# EAGLE design controller (EAGLE 6.6.0)
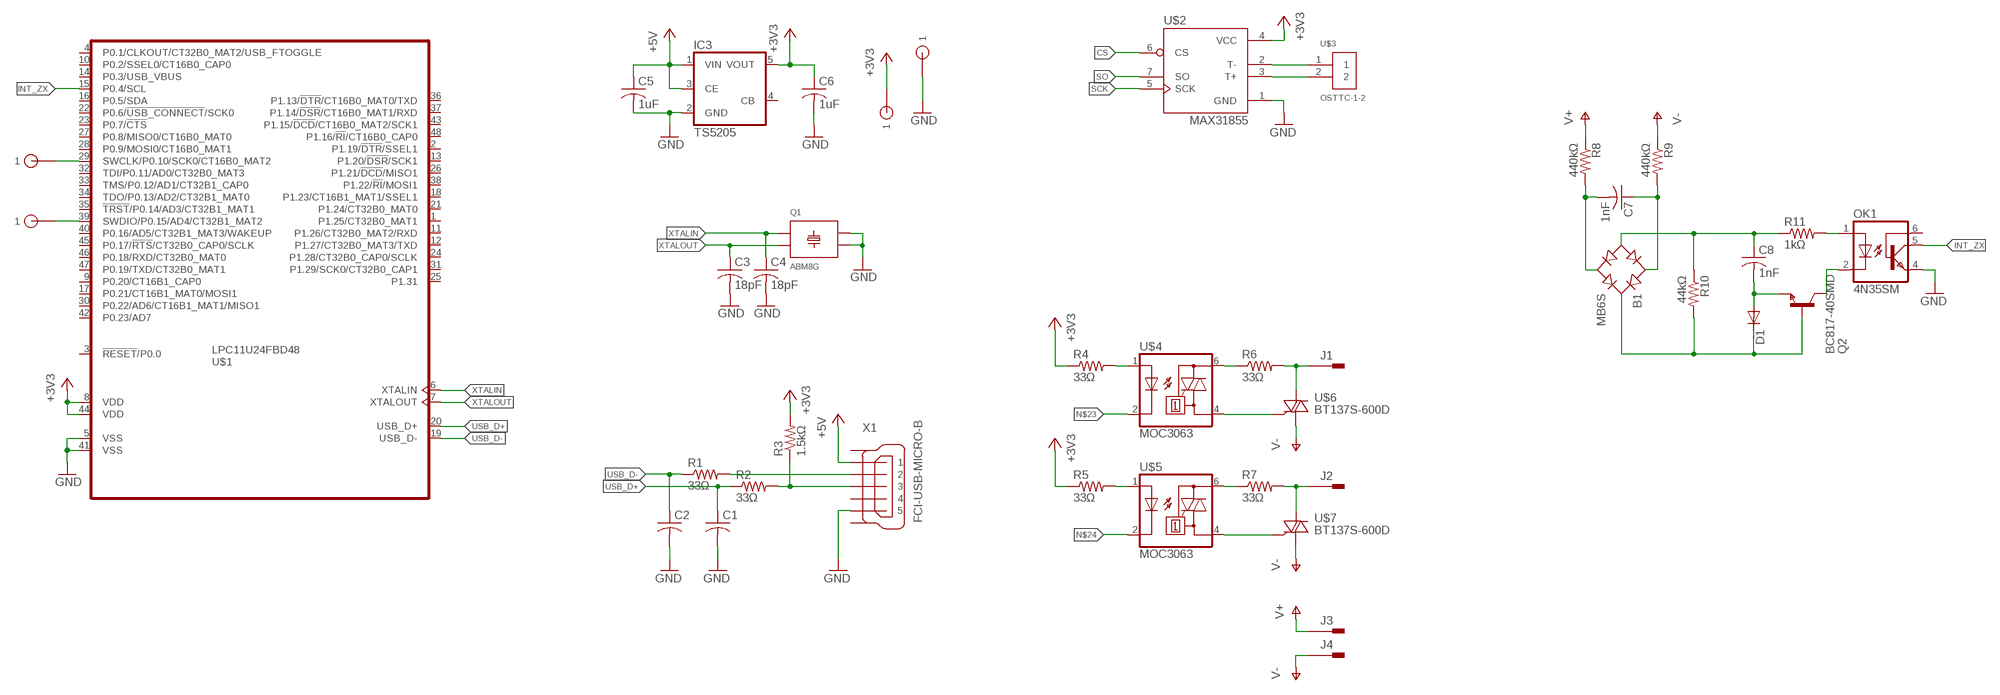
[diagram p0: schematic, sheet 1]

## Parts
B1  MB6S  [SOIC-4]
C1  C-USC0402  [C0402]
C2  C-USC0402  [C0402]
C3  18pF  C-USC0402K  [C0402K]
C4  18pF  C-USC0402K  [C0402K]
C5  1uF  C-USC0402K  [C0402K]
C6  1uF  C-USC0402K  [C0402K]
C7  1nF  C-USC0402K  [C0402K]
C8  1nF  C-USC0402K  [C0402K]
D1  DIODE-SOD80C  [SOD80C]
IC3  TS5205  [SOT25]
J1  PIN2F061.100  [F061.100]
J2  PIN2F061.100  [F061.100]
J3  PIN2F061.100  [F061.100]
J4  PIN2F061.100  [F061.100]
OK1  4N35SM  [DIL6-SMD]
Q1  ABM8G  [SMD-4]
Q2  BC817-40SMD  [SOT23-BEC]
R1  33Ω  R-US_R0402  [R0402]
R2  33Ω  R-US_R0402  [R0402]
R3  1.5kΩ  R-US_R0402  [R0402]
R4  33Ω  R-US_R0402  [R0402]
R5  33Ω  R-US_R0402  [R0402]
R6  33Ω  R-US_R0402  [R0402]
R7  33Ω  R-US_R0402  [R0402]
R8  440kΩ  R-US_R0402  [R0402]
R9  440kΩ  R-US_R0402  [R0402]
R10  44kΩ  R-US_R0402  [R0402]
R11  1kΩ  R-US_R0402  [R0402]
TP1  TESTPOINT  [TESTPOINT-SMD]
TP2  TESTPOINT  [TESTPOINT-SMD]
TP6  TESTPOINT  [TESTPOINT-SMD]
TP7  TESTPOINT  [TESTPOINT-SMD]
U$1  LPC11U24FBD48  [LQFP48]
U$2  MAX31855  [SO08]
U$3  OSTTC-1-2  [OSTTC-1-2]
U$4  MOC3063  [SMD6]
U$5  MOC3063  [SMD6]
U$6  BT137S-600D  [TO-252]
U$7  BT137S-600D  [TO-252]
X1  FCI-USB-MICRO-B  [FCI-MICRO-USB-B]

## Nets
+3V3: C6.1 IC3.5(VOUT) R3.2 R4.1 R5.1 TP6.1 U$1.8(VDD) U$1.44(VDD) U$2.4(VCC)
+5V: C5.1 IC3.1(VIN) IC3.3(CE) X1.1
CS: U$2.6(CS)
GND: C1.2 C2.2 C3.2 C4.2 C5.2 C6.2 IC3.2(GND) OK1.4(EMI) Q1.2(GND1) Q1.4(GND2) TP7.1 U$1.5(VSS) U$1.41(VSS) U$2.1(GND) X1.5
INT_ZX: OK1.5(COL) U$1.15(P0.4/SCL)
N$1: R6.1 U$4.6(A2)
N$2: J2.A1 J2.A2 R7.2 U$7.1(A2)
N$3: R1.2 X1.2
N$4: U$2.2(T-) U$3.1
N$5: U$2.3(T+) U$3.2
N$6: TP2.1 U$1.29(SWCLK/P0.10/SCK0/CT16B0_MAT2)
N$7: R2.2 R3.1 X1.3
N$8: R7.1 U$5.6(A2)
N$9: TP1.1 U$1.39(SWDIO/P0.15/AD4/CT32B1_MAT2)
N$10: R4.2 U$4.1(A)
N$11: R5.2 U$5.1(A)
N$12: J1.A1 J1.A2 R6.2 U$6.1(A2)
N$13: U$4.4(A1) U$6.2(G)
N$14: U$5.4(A1) U$7.2(G)
N$15: B1.- C8.1 R10.1 R11.1
N$16: B1.+ D1.C Q2.B R10.2
N$17: B1.~1(AC1) C7.1 R9.2
N$18: B1.~2(AC2) C7.2 R8.2
N$19: OK1.1(A) R11.2
N$20: OK1.2(C) Q2.C
N$21: C8.2 D1.A Q2.E
N$23: U$4.2(C)
N$24: U$5.2(C)
SCK: U$2.5(SCK)
SO: U$2.7(SO)
USB_D+: C1.1 R2.1 U$1.20(USB_D+)
USB_D-: C2.1 R1.1 U$1.19(USB_D-)
V+: J3.A1 J3.A2 R8.1
V-: J4.A1 J4.A2 R9.1 U$6.3(A1) U$7.3(A1)
XTALIN: C4.1 Q1.1 U$1.6(XTALIN)
XTALOUT: C3.1 Q1.3 U$1.7(XTALOUT)
Unconnected: IC3.4(CB) OK1.6(BAS) U$1.1(P1.25/CT32B0_MAT1) U$1.2(P1.19/!DTR!/SSEL1) U$1.3(!RESET!/P0.0) U$1.4(P0.1/CLKOUT/CT32B0_MAT2/USB_FTOGGLE) U$1.9(P0.20/CT16B1_CAP0) U$1.10(P0.2/SSEL0/CT16B0_CAP0) U$1.11(P1.26/CT32B0_MAT2/RXD) U$1.12(P1.27/CT32B0_MAT3/TXD) U$1.13(P1.20/!DSR!/SCK1) U$1.14(P0.3/USB_VBUS) U$1.16(P0.5/SDA) U$1.17(P0.21/CT16B1_MAT0/MOSI1) U$1.18(P1.23/CT16B1_MAT1/SSEL1) U$1.21(P1.24/CT32B0_MAT0) U$1.22(P0.6/!USB_CONNECT!/SCK0) U$1.23(P0.7/!CTS!) U$1.24(P1.28/CT32B0_CAP0/SCLK) U$1.25(P1.31) U$1.26(P1.21/!DCD!/MISO1) U$1.27(P0.8/MISO0/CT16B0_MAT0) U$1.28(P0.9/MOSI0/CT16B0_MAT1) U$1.30(P0.22/AD6/CT16B1_MAT1/MISO1) U$1.31(P1.29/SCK0/CT32B0_CAP1) U$1.32(TDI/P0.11/AD0/CT32B0_MAT3) U$1.33(TMS/P0.12/AD1/CT32B1_CAP0) U$1.34(TDO/P0.13/AD2/CT32B1_MAT0) U$1.35(!TRST!/P0.14/AD3/CT32B1_MAT1) U$1.36(P1.13/!DTR!/CT16B0_MAT0/TXD) U$1.37(P1.14/!DSR!/CT16B0_MAT1/RXD) U$1.38(P1.22/!RI!/MOSI1) U$1.40(P0.16/AD5/CT32B1_MAT3/WAKEUP) U$1.42(P0.23/AD7) U$1.43(P1.15/!DCD!/CT16B0_MAT2/SCK1) U$1.45(P0.17/!RTS!/CT32B0_CAP0/SCLK) U$1.46(P0.18/RXD/CT32B0_MAT0) U$1.47(P0.19/TXD/CT32B0_MAT1) U$1.48(P1.16/!RI!/CT16B0_CAP0) X1.4

## Power pins joined to a net without a drawn wire
G1: X1.M1(G1)
G2: X1.M2(G2)

## Library data of the parts
B1 = rectifier:MB*S: Bridge Rectifier Source: http://www.fairchildsemi.com/ds/MB/MB6S.pdf
C1-C8 = resistor:C-US: CAPACITOR, American symbol
D1 = diode:DIODE-: DIODE
IC3 = v-reg:TS5205: 150mA Low Noise LDO Voltage Regulator with Enable TSC [Taiwan Semiconductor Company, Ltd] Source: http://www.taiwansemi.com .. 5205_0409c.pdf
J1-J4 = con-faston:PIN2: Flachstecker Typ Tyco/Electronics/AMP TAB, FASTON Printed Circuit Board Tabs Source: http://www.buerklin.com, http://catalog.tycoelectronics.com; OC_FARNELL: unknown; OC_NEWARK: unknown
OK1 = optocoupler:4N*?M: General Purpose 6-Pin Phototransistor Optocouplers Source: http://www.fairchildsemi.com/ds/4N/4N35-M.pdf; MF: FAIRCHILD SEMICONDUCTOR; MPN: 4N35S-M; OC_FARNELL: 1021179; OC_NEWARK: 67K2285
Q1 = Custom:ABM8G; DIGIKEY: 535-10901-1-ND
Q2 = transistor-npn:BC817*: NPN Transistor
R1-R11 = resistor:R-US_: RESISTOR, American symbol
TP1 TP2 TP6 TP7 = Custom:TESTPOINT
U$1 = Custom:LPC11U24FBD48
U$2 = crawford:MAX31855
U$3 = crawford:OSTTC-1-2; DIGIKEY: ED2609-ND
U$4 U$5 = crawford:MOC3063
U$6 U$7 = crawford:BT137S-600D
X1 = Custom:FCI-USB-MICRO-B; DIGIKEY: 609-4616-1-ND

## Board
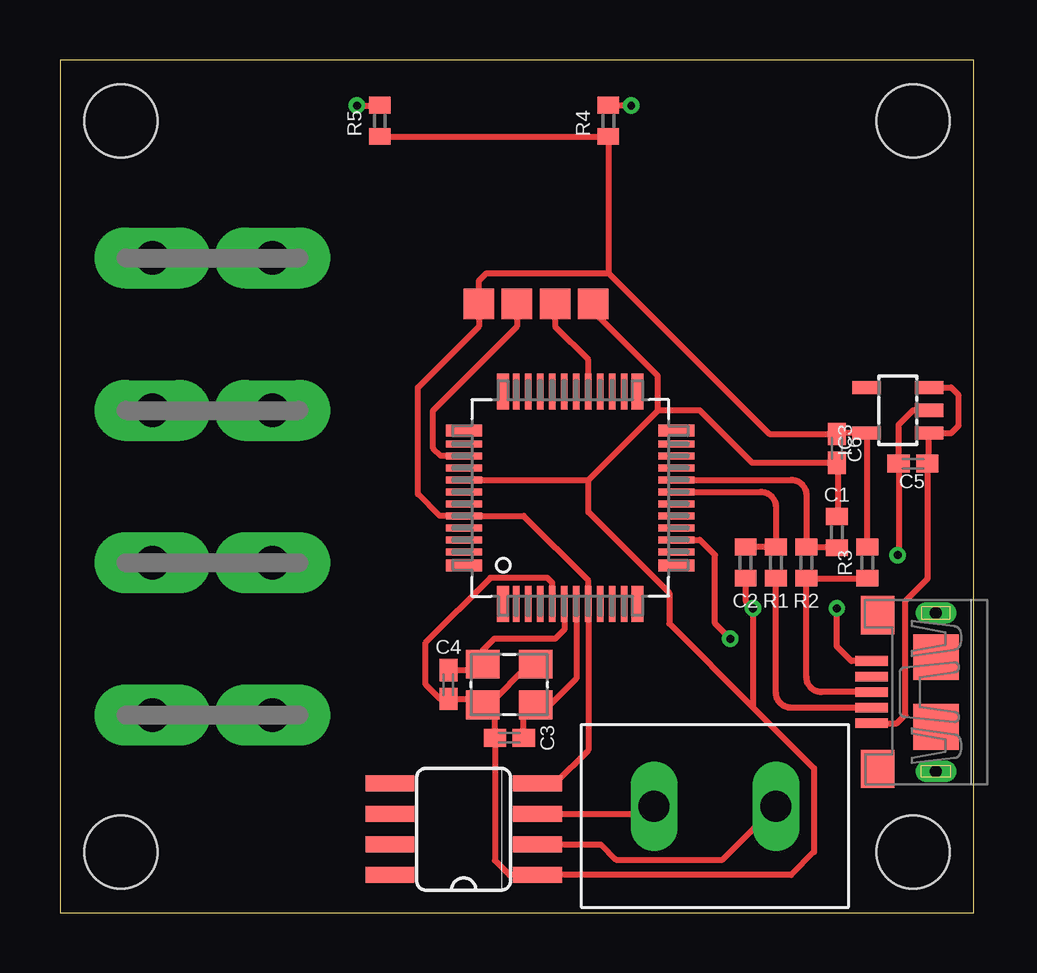
[diagram p1: board, top side]
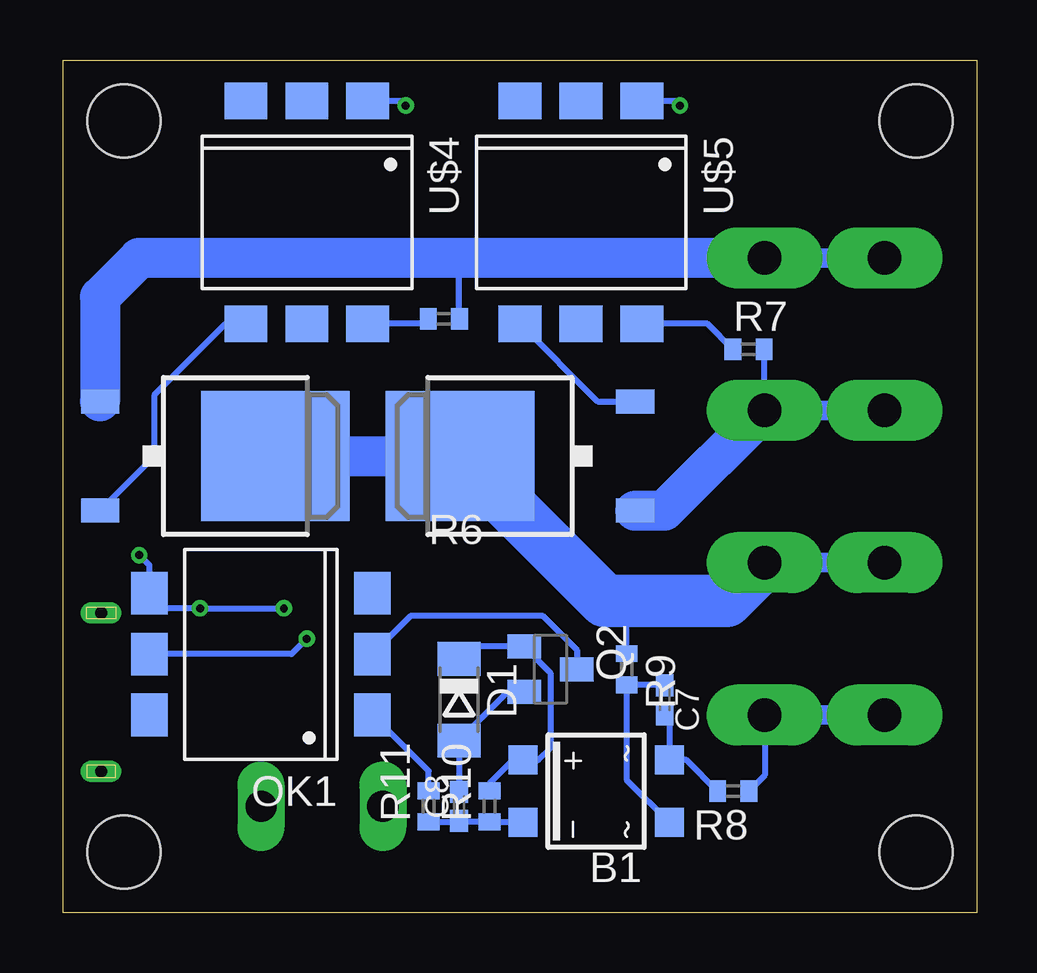
[diagram p2: board, bottom side, seen from below]

Size 38.1 x 35.56 mm. Coordinates in mm from the lower left corner, seen from the top.
Outline: 0,0 38.1,0 38.1,35.56 0,35.56 0,0
Copper layers (1*16): Top 0.0356mm / dielectric 1.5011mm / Bottom 0.0356mm
Design rules "oshpark": minimum track width 6mil, minimum drill 13mil, track to track 6mil, track to pad 6mil, pad to pad 6mil, via to via 6mil, smd to smd 6mil, copper to edge 15mil, drill to drill 6mil, minimum pad ring 7mil, minimum via ring 7mil, stop-mask expansion 4mil, vias tented up to drill 14mil, thermal gap 10mil
Holes 3.05 mm at 2.54,33.02 2.54,2.54 35.56,33.02 35.56,2.54

### Footprints (pad centres in the part's own frame; a part is rotated, then mirrored left to right if it is on the bottom)
SOIC-4 = smd 1.2 x 1.2: + 1.3,3.05; - -1.3,3.05; ~1 -1.3,-3.05; ~2 1.3,-3.05
C0402 = smd 0.7 x 0.9: 1 -0.65,0; 2 0.65,0
C0402K = smd 0.925 x 0.74: 1 -0.6,0; 2 0.6,0
SOD80C = smd 1.4 x 1.8: A 1.7,0; C -1.7,0
SOT25 = smd 0.55 x 1.2: 1 -0.95,-1.3; 2 0,-1.3; 3 0.95,-1.3; 4 0.95,1.3; 5 -0.95,1.3
F061.100 = drill 1.4 pad 2.54 long: A1 -2.5,0; A2 2.5,0
DIL6-SMD = smd 1.78 x 1.52: 1 -2.54,-4.645; 2 0,-4.645; 3 2.54,-4.645; 4 2.54,4.645; 5 0,4.645; 6 -2.54,4.645
SMD-4 = smd 1.4 x 1.2: 1 -1.1,0.85; 2 1.1,0.85; 3 1.1,-0.85; 4 -1.1,-0.85
SOT23-BEC = smd 1 x 1.4: B -0.95,-1.1; C 0,1.1; E 0.95,-1.1
R0402 = smd 0.7 x 0.9: 1 -0.65,0; 2 0.65,0
TESTPOINT-SMD = smd 1.27 x 1.27: 1 0,0
LQFP48 = smd 0.5 x 1.5: 1 -2.81,-4.425; 12 2.81,-4.425; 25 2.81,4.425; 36 -2.81,4.425 | smd 0.28 x 1.5: 2 -2.25,-4.425; 3 -1.75,-4.425; 4 -1.25,-4.425; 5 -0.75,-4.425; 6 -0.25,-4.425; 7 0.25,-4.425; 8 0.75,-4.425; 9 1.25,-4.425; 10 1.75,-4.425; 11 2.25,-4.425; 26 2.25,4.425; 27 1.75,4.425; 28 1.25,4.425; 29 0.75,4.425; 30 0.25,4.425; 31 -0.25,4.425; 32 -0.75,4.425; 33 -1.25,4.425; 34 -1.75,4.425; 35 -2.25,4.425 | smd 1.5 x 0.5: 13 4.425,-2.81; 24 4.425,2.81; 37 -4.425,2.81; 48 -4.425,-2.81 | smd 1.5 x 0.28: 14 4.425,-2.25; 15 4.425,-1.75; 16 4.425,-1.25; 17 4.425,-0.75; 18 4.425,-0.25; 19 4.425,0.25; 20 4.425,0.75; 21 4.425,1.25; 22 4.425,1.75; 23 4.425,2.25; 38 -4.425,2.25; 39 -4.425,1.75; 40 -4.425,1.25; 41 -4.425,0.75; 42 -4.425,0.25; 43 -4.425,-0.25; 44 -4.425,-0.75; 45 -4.425,-1.25; 46 -4.425,-1.75; 47 -4.425,-2.25
SO08 = smd 0.66 x 2.032: 1 -1.905,-3.073; 2 -0.635,-3.073; 3 0.635,-3.073; 4 1.905,-3.073; 5 1.905,3.073; 6 0.635,3.073; 7 -0.635,3.073; 8 -1.905,3.073
OSTTC-1-2 = drill 1.3 long: 1 0,2.54; 2 0,-2.54
SMD6 = smd 1.78 x 1.52: 1 -2.54,-4.645; 2 0,-4.645; 3 2.54,-4.645; 4 2.54,4.645; 5 0,4.645; 6 -2.54,4.645
TO-252 = smd 1 x 1.6: 1 -2.28,-4.8; 2 2.28,-4.8 | smd 5.4 x 6.2: 3 0,2.5
FCI-MICRO-USB-B = smd 1.35 x 0.4: 1 2.675,1.3; 2 2.675,0.65; 3 2.675,0; 4 2.675,-0.65; 5 2.675,-1.3 | drill 0.5 pad 0.9 long: M1 0,3.3; M2 0,-3.3 | smd 1.4 x 1.6: P$1 2.425,3.2; P$2 2.425,-3.2 | smd 1.9 x 1.9: P$3 0,1.45; P$4 0,-1.45

### Placement (x,y rotation side)
B1  15.88,5.08 90 bottom
C1  32.38,15.88 90 top
C2  28.57,14.61 270 top
C3  18.73,7.3 180 top
C4  16.19,9.52 270 top
C5  35.56,18.73 180 top
C6  32.38,19.37 270 top
C7  13.02,8.89 270 bottom
C8  21.59,4.45 90 bottom
D1  21.59,8.89 270 bottom
IC3  34.92,20.96 90 top
J1  6.35,27.3 0 top
J2  6.35,20.96 0 top
J3  6.35,8.25 0 top
J4  6.35,14.61 0 top
OK1  29.84,10.8 90 bottom
Q1  18.73,9.52 0 top
Q2  17.78,10.16 270 bottom
R1  29.84,14.61 270 top
R2  31.11,14.61 270 top
R3  33.66,14.61 90 top
R4  22.86,33.02 90 top
R5  13.34,33.02 90 top
R6  22.23,24.77 0 bottom
R7  9.53,23.5 0 bottom
R8  10.16,5.08 180 bottom
R9  14.61,10.16 270 bottom
R10  20.32,4.45 90 bottom
R11  22.86,4.45 90 bottom
TP1  19.05,25.4 0 top
TP2  20.64,25.4 0 top
TP6  17.46,25.4 0 top
TP7  22.23,25.4 0 top
U$1  21.27,17.3 0 top
U$2  16.83,3.49 90 top
U$3  27.3,4.45 270 top
U$4  27.94,29.21 180 bottom
U$5  16.51,29.21 180 bottom
U$6  31.75,19.05 270 bottom
U$7  19.05,19.05 90 bottom
X1  36.51,9.21 180 top

### Tracks (layer width: path | path; a pad name or v marks a point on that pad's centre or on a via)
+3V3
  Top 0.254: R5.1 R4.1 22.86,26.67 | U$2.4 20.64,5.4 22.02,6.78 U$1.8 22.02,13.86 19.32,16.55 U$1.44 15.83,16.55 14.92,17.46 14.92,21.91 17.46,24.45 TP6.1 17.46,26.35 17.78,26.67 22.86,26.67 | R3.2 33.66,20.01 IC3.5 32.42,20.01 C6.1 29.56,19.97 22.86,26.67
+5V
  Top 0.254: IC3.1 37.15,20.01 37.47,20.32 37.47,21.59 37.15,21.91 IC3.3 36.16,21.97 | 36.16,19.94 IC3.1 | IC3.1 36.23,18.73 C5.1 36.16,13.94 35.24,13.02 35.24,8.25 34.9,7.91 X1.1
GND  (via drill 0.33)
  Top 0.254: Q1.4 17.38,8.93 C4.2 15.84,8.93 15.24,9.52 15.24,11.27 17.94,13.97 20.32,13.97 20.52,13.77 U$1.5 | Q1.4 18.13,8.18 C3.2 18.13,2.19 18.73,1.59 U$2.1 30.48,1.59 31.43,2.54 31.43,6.03 28.89,8.57 | Q1.4 17.88,8.68 19.58,10.38 Q1.2 | C2.2 28.57,13.02 v28.89,12.7 28.89,8.57 | X1.5 32.99,10.51 32.38,11.11 v32.38,12.7 | C1.2 32.42,16.56 32.42,18.73 C6.2 28.86,18.77 26.67,20.96 24.92,20.96 | 28.89,8.57 25.4,12.07 25.4,13.34 22.02,16.71 22.02,18.05 | U$1.41 22.02,18.05 | 22.02,18.05 24.92,20.96 | 24.92,20.96 24.92,22.38 22.23,25.08 TP7.1 | IC3.2 35.56,20.96 34.96,20.36 C5.2 34.96,14.96 v34.92,14.92
  Bottom 0.254: v28.89,12.7 v32.38,12.7 33.85,12.7 OK1.4 34.49,14.49 v34.92,14.92
INT_ZX  (via drill 0.33)
  Top 0.254: U$1.15 26.67,15.55 27.3,14.92 27.3,12.07 v27.94,11.43
  Bottom 0.254: v27.94,11.43 28.57,10.8 OK1.5
N$1
  Bottom 0.254: R6.1 23.07,24.57 U$4.6
N$2
  Bottom 0.254: R7.2 8.88,20.98 J2.A2
  Bottom 0.813: J2.A1 J2.A2
  Bottom 1.676: U$7.1 13.04,16.77 J2.A2
N$3
  Top 0.254: X1.2 30.48,8.56 arc-90 29.84,9.19 R1.2
N$4
  Top 0.254: U$2.2 22.54,2.86 23.18,2.22 27.62,2.22 U$3.1
N$5
  Top 0.254: U$2.3 24.45,4.13 U$3.2
N$6
  Top 0.254: U$1.29 22.02,23.06 20.64,24.45 TP2.1
N$7
  Top 0.254: X1.3 31.75,9.21 arc-90 31.11,9.84 R2.2 R3.1
N$8
  Bottom 0.254: R7.1 11.24,24.57 U$5.6
N$9
  Top 0.254: U$1.39 15.88,19.05 15.56,19.37 15.56,20.96 19.05,24.45 TP1.1
N$10  (via drill 0.33)
  Top 0.254: v23.81,33.66 22.88,33.66 R4.2
  Bottom 0.254: U$4.1 24.01,33.86 v23.81,33.66
N$11  (via drill 0.33)
  Top 0.254: v12.38,33.66 13.32,33.66 R5.2
  Bottom 0.254: U$5.1 12.58,33.86 v12.38,33.66
N$12
  Bottom 0.254: 8.88,27.33 J1.A2 | R6.2 21.59,24.78 21.59,27.3
  Bottom 0.813: J1.A1 J1.A2
  Bottom 1.676: J1.A2 21.59,27.3 34.92,27.3 36.55,25.68 U$6.1
N$13
  Bottom 0.254: U$6.2 34.29,19.03 34.29,21.59 31.32,24.57 U$4.4
N$14
  Bottom 0.254: 14.98,21.33 U$7.2 15.81,21.33 U$5.4
N$15
  Bottom 0.254: B1.- 20.3,3.78 R10.1 21.54,3.79 C8.1 21.64,3.79 R11.1
N$16
  Bottom 0.254: D1.C 21.07,11.11 Q2.B 17.78,10.01 17.78,6.89 18.29,6.38 B1.+ 19.34,6.38 20.32,5.4 R10.2
N$17
  Bottom 0.254: B1.~1 14.61,5.56 R9.2 13.04,9.51 C7.1
N$18
  Bottom 0.254: R8.2 12.11,6.38 B1.~2 12.82,8.1 C7.2
N$19
  Bottom 0.254: R11.2 22.86,5.92 OK1.1
N$20
  Bottom 0.254: OK1.2 23.61,12.38 18.1,12.38 16.68,10.96 Q2.C
N$21
  Bottom 0.254: C8.2 D1.A 19.57,9.21 Q2.E
USB_D+
  Top 0.254: U$1.20 30.48,18.05 arc-90 31.11,17.42 R2.1 32.35,15.26 C1.1
USB_D-
  Top 0.254: C2.1 R1.1 29.84,16.92 arc90 29.21,17.55 U$1.19
V+
  Bottom 0.254: J3.A2 8.85,5.74 R8.1
  Bottom 0.813: J3.A1 J3.A2
V-
  Bottom 0.254: R9.1 14.61,13.02
  Bottom 0.813: J4.A1 J4.A2
  Bottom 1.676: U$6.3 U$7.3
  Bottom 2.184: J4.A2 10.44,13.02 14.61,13.02 15.52,13.02 U$7.3
XTALIN
  Top 0.254: U$1.6 21.02,11.82 20.64,11.43 18.1,11.43 17.63,10.96 Q1.1 17.38,10.12 C4.1
XTALOUT
  Top 0.254: U$1.7 21.52,9.77 20.42,8.68 Q1.3 19.33,8.18 C3.1

### Text on the board
tValues: BOTTOM | TOP | HOT | NEUTRAL